# Altium schematic sheet Copy yhh.SchDoc
size A3; DrawnBy: YHJ
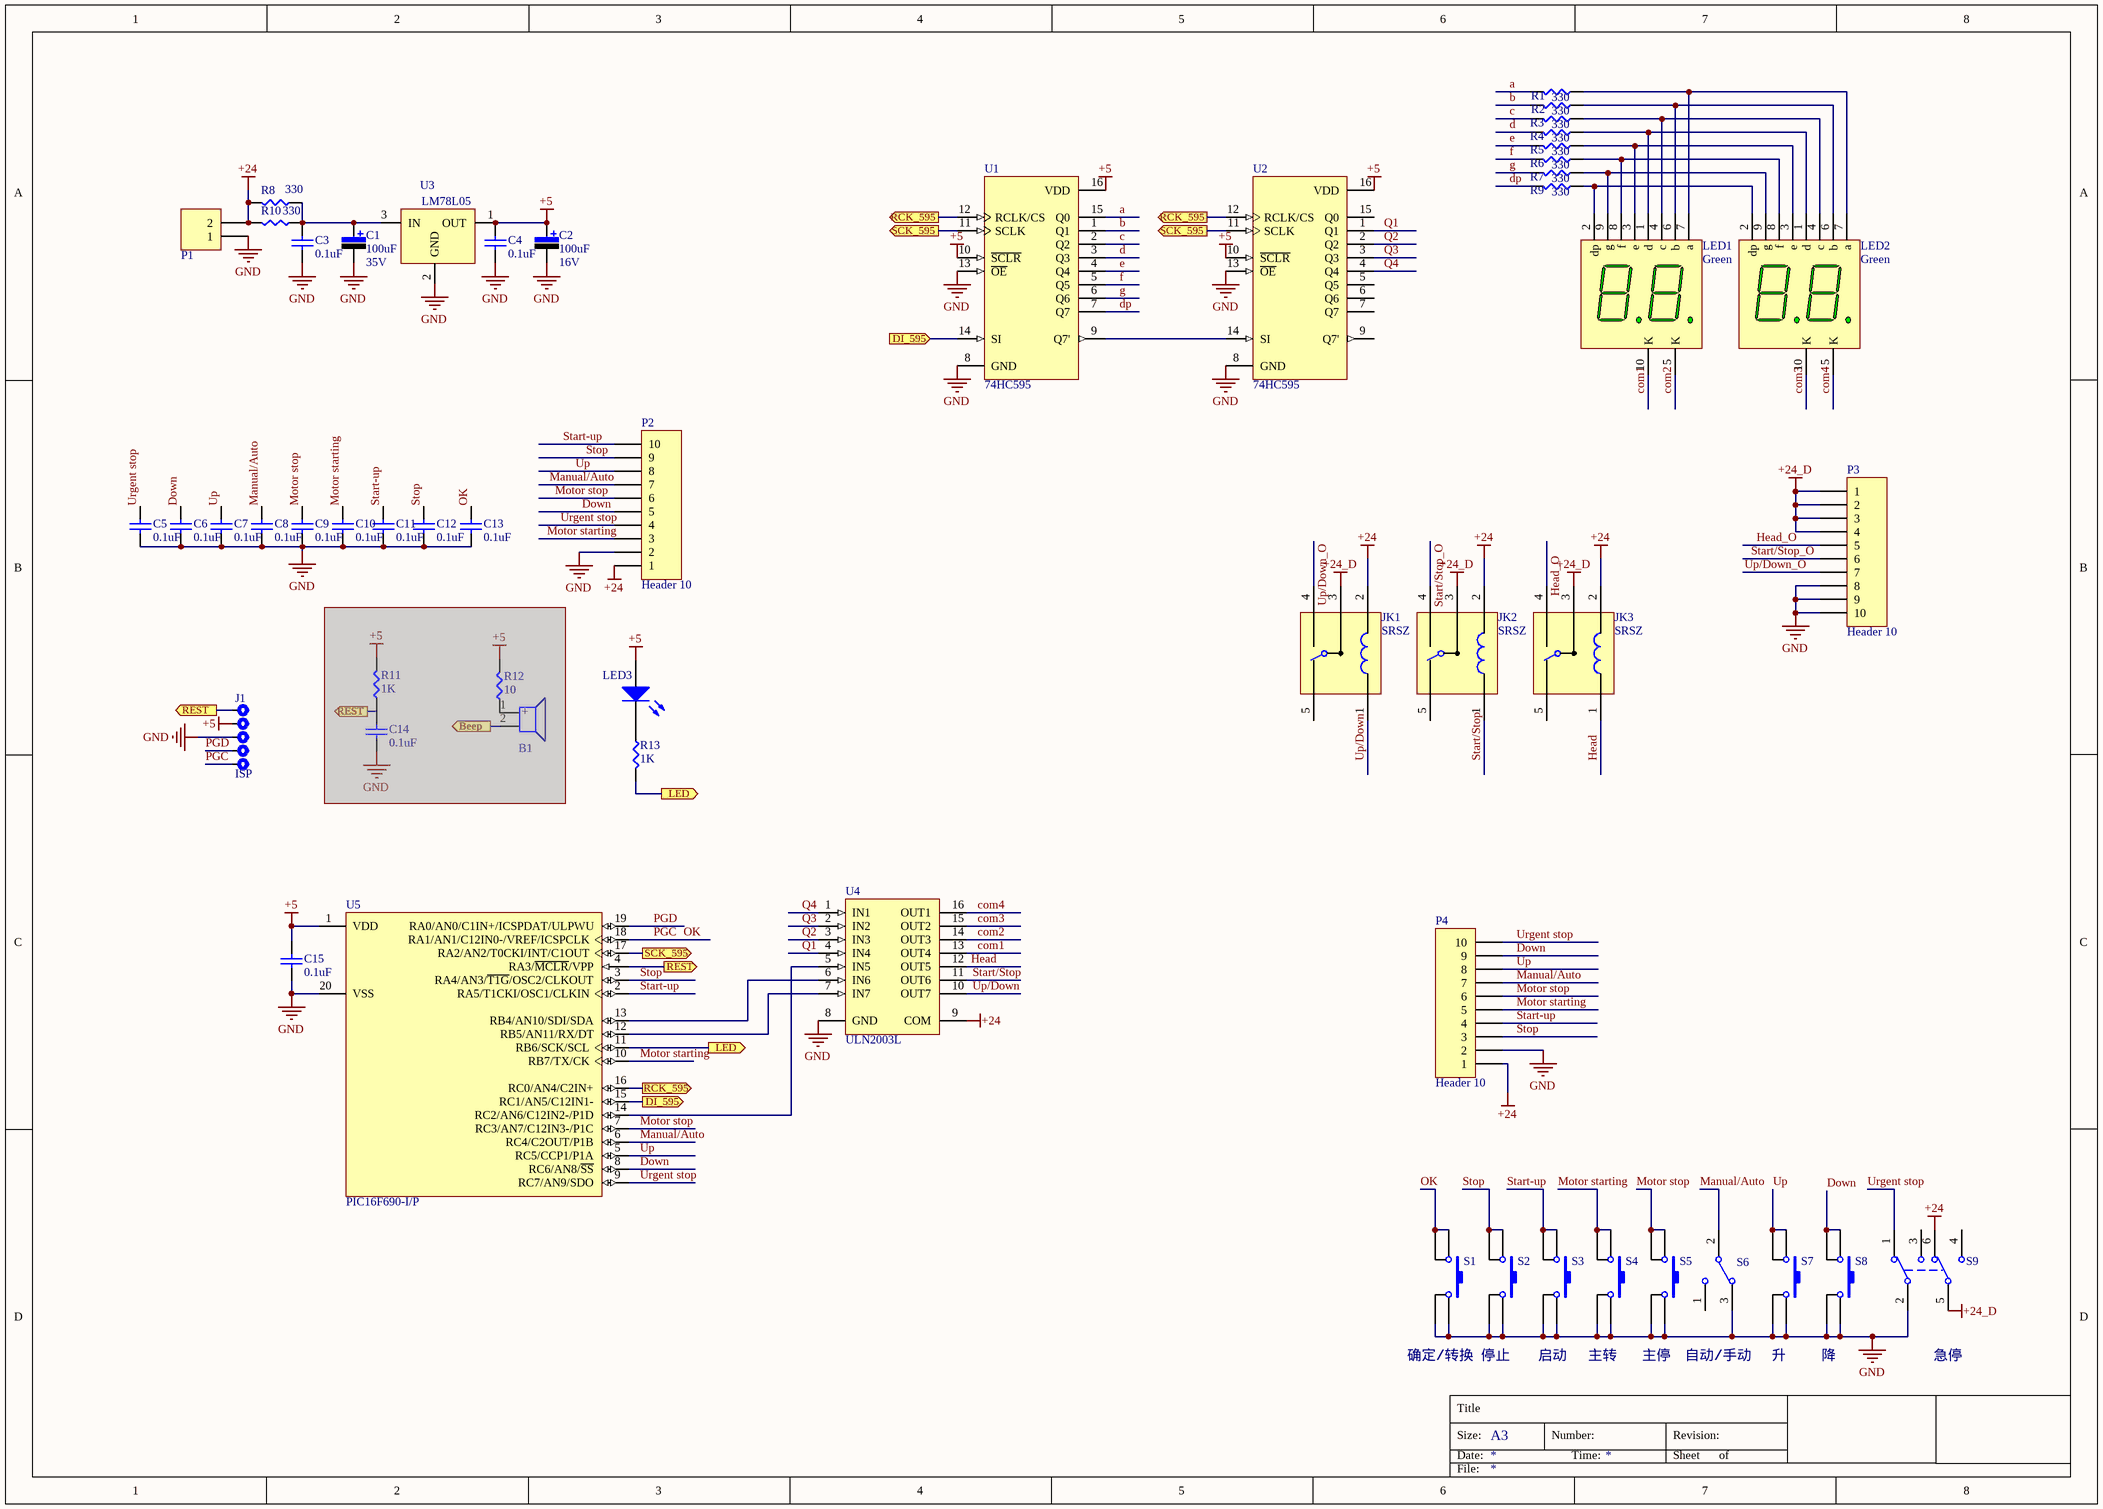
[diagram p0: Copy yhh.SchDoc]

## Parts
B1  BEEP  (value not drawn)  (masked out: inside a compile mask, not in the netlist)
C1  value 100uF  Vol: 35V  [CAL6.3x8]  (hidden comment: Cap Pol)
C2  value 100uF  Vol: 16V  [TA3216]  (hidden comment: Cap Pol)
C3  0.1uF  [C0805(2012)]
C4  0.1uF  [C0805(2012)]
C5  0.1uF  [C0805(2012)]
C6  0.1uF  [C0805(2012)]
C7  0.1uF  [C0805(2012)]
C8  0.1uF  [C0805(2012)]
C9  0.1uF  [C0805(2012)]
C10  0.1uF  [C0805(2012)]
C11  0.1uF  [C0805(2012)]
C12  0.1uF  [C0805(2012)]
C13  0.1uF  [C0805(2012)]
C14  0.1uF  [C0805(2012)]  (masked out: inside a compile mask, not in the netlist)
C15  0.1uF  [C0805(2012)]
J1  ISP  [HDR1X6]
JK1  SRSZ  [RELAY_SRSZ]
JK2  SRSZ  [RELAY_SRSZ]
JK3  SRSZ  [RELAY_SRSZ]
LED1  Green  [LED_KRS-8201CPG-3.5]
LED2  Green  [LED_KRS-8201CPG-3.5]
LED3  LED  [LED_0805]  (value not drawn)
P1  Header 2  [HDR1X2]  (value not drawn)
P2  Header 10  [CON_DEGSON236_5_10P]
P3  Header 10  [CON_DEGSON236_5_10P]
P4  Header 10
R1  330  [R0805(2012)]
R2  330  [R0805(2012)]
R3  330  [R0805(2012)]
R4  330  [R0805(2012)]
R5  330  [R0805(2012)]
R6  330  [R0805(2012)]
R7  330  [R0805(2012)]
R8  330  [R1206(3216)]
R9  330  [R0805(2012)]
R10  330  [R1206(3216)]
R11  1K  [R0805(2012)]  (masked out: inside a compile mask, not in the netlist)
R12  10  [R0805(2012)]  (masked out: inside a compile mask, not in the netlist)
R13  1K  [R0805(2012)]
S1  SW-PB4  [KEY_6x6]  (value not drawn)
S2  SW-PB4  (value not drawn)
S3  SW-PB4  (value not drawn)
S4  SW-PB4  (value not drawn)
S5  SW-PB4  (value not drawn)
S6  SW-SPDT  (value not drawn)
S7  SW-PB4  (value not drawn)
S8  SW-PB4  (value not drawn)
S9  SW-DPDT  (value not drawn)
U1  74HC595  [SOP16]
U2  74HC595  [SOP16]
U3  LM78L05  [SOT89_3L]
U4  ULN2003L  [SOP16]
U5  PIC16F690-I/P  [DIP20]

## Ports
Beep (out), DI_595 (in), DI_595 (out), LED (out), RCK_595 (out), REST (out), SCK_595 (out)

## Nets
+5: C2.1 C4.1 C15.1 J1.2 LED3.1(A) U1.10(~{SCLR}) U1.16(VDD) U2.10(~{SCLR}) U2.16(VDD) U3.1(OUT) U5.1(VDD)
+24: JK1.2 JK2.2 JK3.2 P1.2 P2.1 P4.1 R8.1 R10.1 S9.6 U4.9(COM)
+24_D: JK1.3 JK2.3 JK3.3 P3.1 P3.2 P3.3 P3.4 S9.5
GND: C1.2 C2.2 C3.2 C4.2 C5.1 C6.2 C7.1 C8.1 C9.2 C10.1 C11.2 C12.1 C13.2 C15.2 J1.3 P1.1 P2.2 P3.8 P3.9 P3.10 P4.2 S1.2 S1.3 S2.2 S2.3 S3.2 S3.3 S4.2 S4.3 S5.2 S5.3 S6.3 S7.2 S7.3 S8.2 S8.3 S9.2 U1.8(GND) U1.13(~{OE}) U2.8(GND) U2.13(~{OE}) U3.2(GND) U4.8(GND) U5.20(VSS)
a: R1.1 U1.15(Q0)
b: R2.1 U1.1(Q1)
c: R3.1 U1.2(Q2)
com1: LED1.10(K) U4.13(OUT4)
com2: LED1.5(K) U4.14(OUT3)
com3: LED2.10(K) U4.15(OUT2)
com4: LED2.5(K) U4.16(OUT1)
d: R4.1 U1.3(Q3)
DI_595: U1.14(SI) U5.15(RC1/AN5/C12IN1-) ; port DI_595
Down: C6.1 P2.5 P4.9 S8.1 S8.4 U5.8(RC6/AN8/~{SS})
dp: R9.1 U1.7(Q7)
e: R5.1 U1.4(Q4)
f: R6.1 U1.5(Q5)
g: R7.1 U1.6(Q6)
Head: JK3.1 U4.12(OUT5)
Head_O: JK3.4 P3.5
LED: R13.1 U5.11(RB6/SCK/SCL) ; port LED
Manual/Auto: C8.2 P2.7 P4.7 S6.2 U5.6(RC4/C2OUT/P1B)
Motor starting: C10.2 P2.3 P4.5 S4.1 S4.4 U5.10(RB7/TX/CK)
Motor stop: C9.1 P2.6 P4.6 S5.1 S5.4 U5.7(RC3/AN7/C12IN3-/P1C)
OK: C13.1 J1.5 S1.1 S1.4 U5.18(RA1/AN1/C12IN0-/VREF/ICSPCLK)  [also labelled PGC]
PGD: J1.4 U5.19(RA0/AN0/C1IN+/ICSPDAT/ULPWU)
Q1: U2.1(Q1) U4.4(IN4)
Q2: U2.2(Q2) U4.3(IN3)
Q3: U2.3(Q3) U4.2(IN2)
Q4: U2.4(Q4) U4.1(IN1)
RCK_595: U1.12(RCLK/CS) U2.12(RCLK/CS) U5.16(RC0/AN4/C2IN+) ; port RCK_595
REST: J1.1 U5.4(RA3/~{MCLR}/VPP) ; port REST
SCK_595: U1.11(SCLK) U2.11(SCLK) U5.17(RA2/AN2/T0CKI/INT/C1OUT) ; port SCK_595
Start-up: C11.1 P2.10 P4.4 S3.1 S3.4 U5.2(RA5/T1CKI/OSC1/CLKIN)
Start/Stop: JK2.1 U4.11(OUT6)
Start/Stop_O: JK2.4 P3.6
Stop: C12.2 P2.9 P4.3 S2.1 S2.4 U5.3(RA4/AN3/~{T1G}/OSC2/CLKOUT)
Up: C7.2 P2.8 P4.8 S7.1 S7.4 U5.5(RC5/CCP1/P1A)
Up/Down: JK1.1 U4.10(OUT7)
Up/Down_O: JK1.4 P3.7
Urgent stop: C5.2 P2.4 P4.10 S9.1 U5.9(RC7/AN9/SDO)
NetC1_1: C1.1 C3.1 R8.2 R10.2 U3.3(IN)
NetLED1_1: LED1.1(d) LED2.1(d) R4.2
NetLED1_2: LED1.2(dp) LED2.2(dp) R9.2
NetLED1_3: LED1.3(e) LED2.3(e) R5.2
NetLED1_4: LED1.4(c) LED2.4(c) R3.2
NetLED1_6: LED1.6(b) LED2.6(b) R2.2
NetLED1_7: LED1.7(a) LED2.7(a) R1.2
NetLED1_8: LED1.8(f) LED2.8(f) R6.2
NetLED1_9: LED1.9(g) LED2.9(g) R7.2
NetLED3_2: LED3.2(K) R13.2
NetU1_9: U1.9(Q7') U2.14(SI)
NetU4_5: U4.5(IN5) U5.14(RC2/AN6/C12IN2-/P1D)
NetU4_6: U4.6(IN6) U5.13(RB4/AN10/SDI/SDA)
NetU4_7: U4.7(IN7) U5.12(RB5/AN11/RX/DT)

Not connected (* = marked no-connect by the designer): JK1 5; JK2 5; JK3 5; S6 1; S9 3 4; U2 5(Q5) 6(Q6) 7(Q7) 9(Q7') 15(Q0)

## Notes on the sheet
- 确定/转换
- 停止
- 启动
- 主转
- 主停
- 自动/手动
- 升
- 降
- 急停
- Title
- Size:
- Date:
- A3
- Number:
- Time:
- Revision:
- Sheet
- of
- File:
- (in symbol BEEP) +

## Library data of the parts
C1 C2 = Cap Pol: 极性钽电容; Published: 8-Jun-2000; LatestRevisionDate: 17-Jul-2002; LatestRevisionNote: Re-released for DXP Platform.; PackageReference: RB7.6-15; Publisher: Altium Limited
C3-C15 = Cap: 无极性电容; Published: 8-Jun-2000; LatestRevisionDate: 17-Jul-2002; LatestRevisionNote: Re-released for DXP Platform.; Publisher: Altium Limited
J1 = ISP_5
JK1-JK3 = RELAY_SRSZ: 单刀双掷继电器
LED1 LED2 = LED_KRS-8201CPG-3.5: 共阴1寸LED; dP段电压(10ｍA): 4V; 段电压(10ｍA): 7.7V; 段电压(14ｍA): 7.8; dP段电压(14ｍA): 4V
LED3 = LED: 发光二极管; Published: 8-Jun-2000; LatestRevisionDate: 08-Jul-2005; LatestRevisionNote: Mech Layer 1 removed.; PackageReference: LED-0; Publisher: Altium Limited
P1 = Header 2: 接插件; LatestRevisionDate: 17-Jul-2002; LatestRevisionNote: Re-released for DXP Platform.; Publisher: Altium Limited
P2-P4 = Header 10: Header, 10-Pin; LatestRevisionDate: 17-Jul-2002; LatestRevisionNote: Re-released for DXP Platform.; Publisher: Altium Limited
R1-R13 = Res: Resistor; Published: 8-Jun-2000; LatestRevisionDate: 17-Jul-2002; Publisher: Altium Limited; PackageDescription: Axial Device, Thru-Hole; 2 Leads; 0.7 in Pin Spacing
S1-S5 S7 S8 = SW-PB4: 微动开关; Published: 24-Mar-1999; LatestRevisionDate: 17-Jul-2002; LatestRevisionNote: Re-released for DXP Platform.; PackageReference: SPST-2; Publisher: Altium Limited
S6 = SW-SPDT: 开关; Published: 24-Mar-1999; LatestRevisionDate: 17-Dec-2003; LatestRevisionNote: Schematic revised, PCB Footprint replaced.; PackageReference: TL36WW15050; Publisher: Altium Limited; DatasheetDocument: 05-Dec-2000; ComponentLink1Description: Manufacturer Link; ComponentLink1URL: http://www.apem.com
S9 = SW-DPDT: 单刀双掷开关; Published: 24-Mar-1999; LatestRevisionDate: 17-Jul-2002; LatestRevisionNote: Re-released for DXP Platform.; PackageReference: DPDT-6; Publisher: Altium Limited
U1 U2 = 74HC595: 移位寄存器; ComponentAvailability: Not for New Design; Published: 15-Apr-2002; LatestRevisionDate: 13-Apr-2006; LatestRevisionNote: IPC-7351 Footprint Added.; DatasheetVersion: 1997; PackageVersion: 1997; PackageReference: 966-01; Publisher: Altium Limited; PackageDescription: 16-Pin Small Outline Package 1.27 mm Pitch; ComponentLink1Description: Manufacturer Link; ComponentLink1URL: http://www.onsemi.com/; ComponentLink2Description: Datasheet; ComponentLink2URL: http://www.onsemi.com/pub/Collateral/MC74VHC595-D.PDF
U3 = LM78LXX
U4 = ULN2003L: 驱动芯片; Published: 13-Oct-2000; LatestRevisionDate: 13-Apr-2006; LatestRevisionNote: IPC-7351 Footprint Added.; DatasheetVersion: 1998; PackageReference: L16; Publisher: Altium Limited; PackageDescription: 16-Pin Small Outline Integrated Circuit 1.27 mm Pitch; Code_JEDEC: MS-012-AC; Code_IPC: SOIC127P600-16; ComponentLink1Description: Manufacturer Link; ComponentLink1URL: http://www.allegromicro.com/
U5 = PIC16F690-I/P: Flash-Based, 8-Bit CMOS Microcontroller with nanoWatt Technology, 4K (x14-Bit words) Program Memory, 512 Bytes Data Memory, 18 I/O pins, 20-Pin PDIP, Standard VDD Range, Industrial Temperature; Published: 29-Jan-2009; DatasheetVersion: revE, Mar-2008; PackageVersion: revBB, Aug-2009; PackageReference: PDIP300-P20; Publisher: Altium Limited; PackageDescription: 20-Lead Plastic Dual In-Line (P) - 300 mil Body [PDIP]; Supplier 1: Digi-Key; Supplier Part Number 1: PIC16F690-I/P-ND; Supplier 2: Farnell; Supplier Part Number 2: 1103406; Supplier 3: Farnell; Supplier Part Number 3: 1523800; ComponentLink1Description: Datasheet; ComponentLink1URL: http://ww1.microchip.com/downloads/en/DeviceDoc/41262E.pdf; ComponentLink2Description: Packaging Specification; ComponentLink2URL: http://www.microchip.com/stellent/groups/techpub_sg/documents/packagingspec/en012702.pdf; ComponentLink3Description: Microchip.com Home; ComponentLink3URL: http://www.microchip.com/